# EAGLE schematic uc3843 basic (EAGLE 7.7.0)

## Sheet 1 of 2
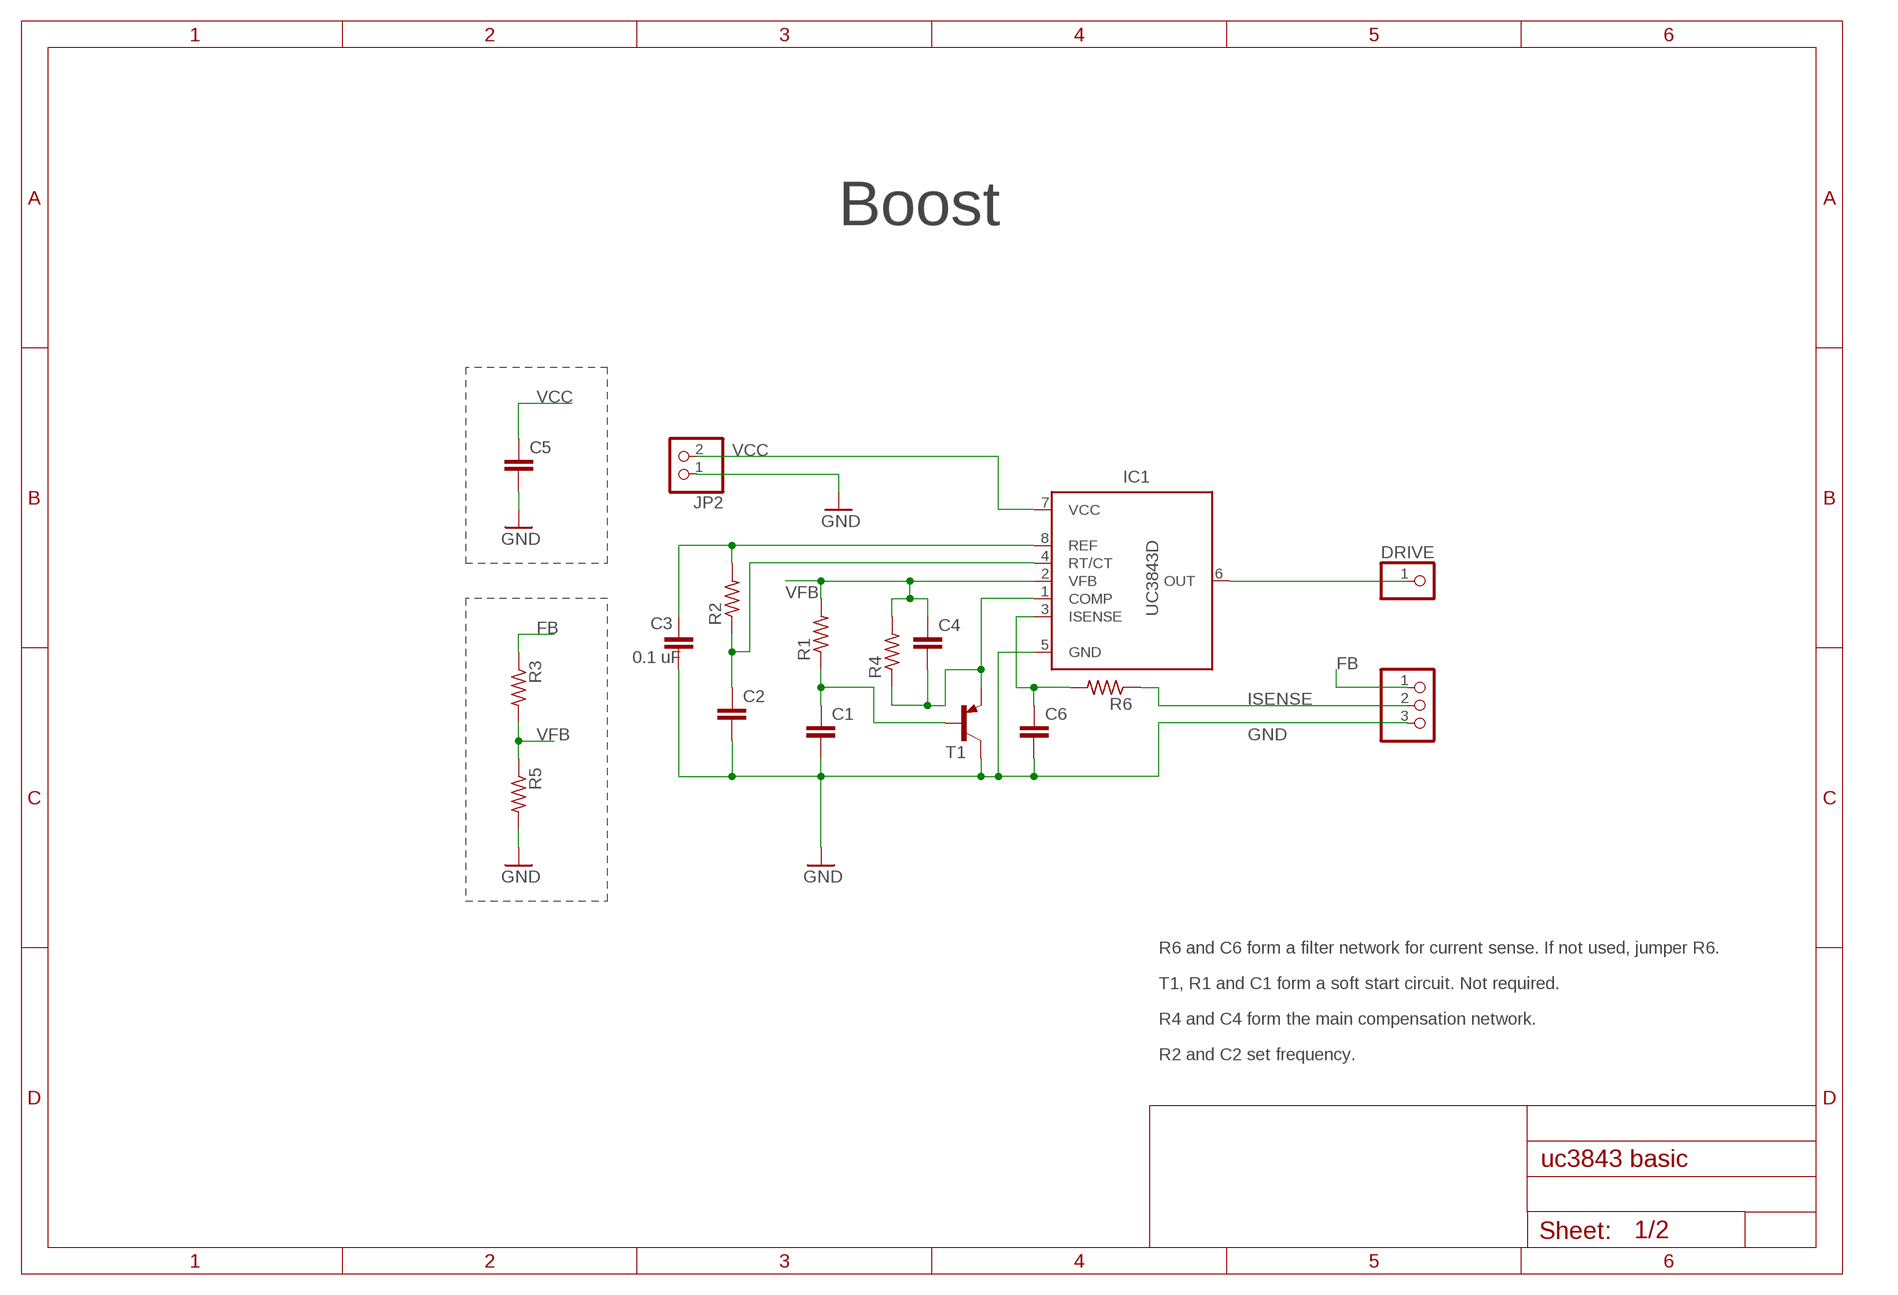
[diagram p0: schematic, sheet 1]

### Parts
C1  C-EUC0805  [C0805]
C2  C-EUC0805  [C0805]
C3  0.1 uF  C-EUC0805  [C0805]
C4  C-EUC0805  [C0805]
C5  C-EUC0805  [C0805]
C6  C-EUC0805  [C0805]
DRIVE  PINHD-1X1  [1X01]
IC1  UC3843D  [D_R-PDSO-G08]
JP1  PINHD-1X3  [1X03]
JP2  PINHD-1X2  [1X02]
R1  R-US_R0805  [R0805]
R2  R-US_R0805  [R0805]
R3  R-US_R0805  [R0805]
R4  R-US_R0805  [R0805]
R5  R-US_R0805  [R0805]
R6  R-US_R0805  [R0805]
T1  -PNP-SOT23-BCE  [SOT23-BCE]

### Nets
COMP: C4.2 IC1.1(COMP) R4.1 T1.E
FB: JP1.1 R3.1
GND: C1.2 C2.2 C3.2 C5.2 C6.2 IC1.5(GND) JP1.3 JP2.1 R5.2 T1.C ; also sheet 2
ISENSE: C6.1 IC1.3(ISENSE) R6.2 ; also sheet 2
N$1: JP1.2 R6.1
N$4: C1.1 R1.1 T1.B
N$6: C2.1 IC1.4(RT/CT) R2.1
N$7: DRIVE.1 IC1.6(OUT)
REF: C3.1 IC1.8(REF) R2.2
VCC: C5.1 IC1.7(VCC) JP2.2 ; also sheet 2
VFB: C4.1 IC1.2(VFB) R1.2 R3.2 R4.2 R5.1 ; also sheet 2

### Notes on the sheet
- Boost
- R6 and C6 form a filter network for current sense. If not used, jumper R6.
- T1, R1 and C1 form a soft start circuit. Not required.
- R4 and C4 form the main compensation network.
- R2 and C2 set frequency.

## Sheet 2 of 2
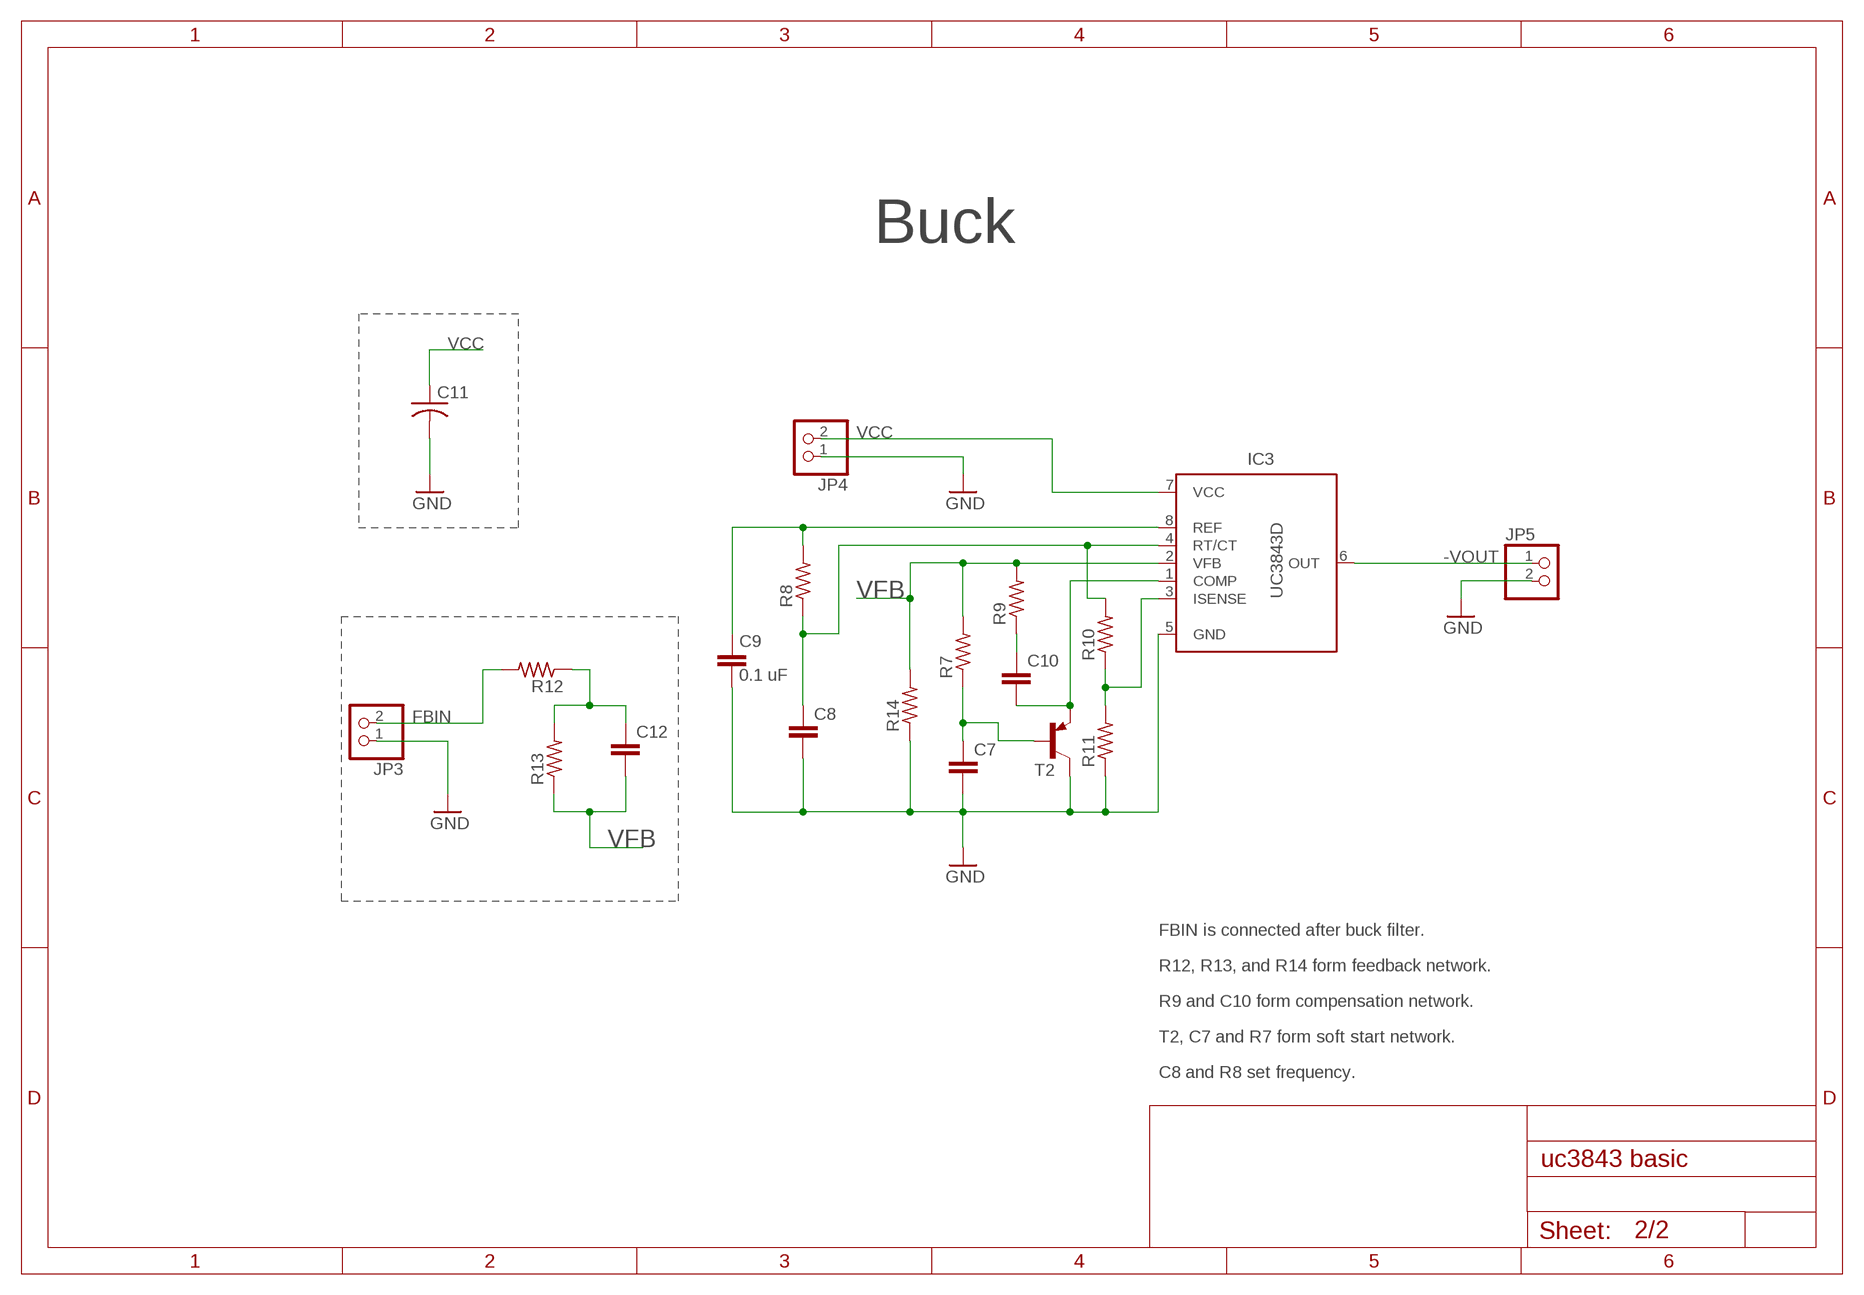
[diagram p1: schematic, sheet 2]

### Parts
C7  C-EUC0805  [C0805]
C8  C-EUC0805  [C0805]
C9  0.1 uF  C-EUC0805  [C0805]
C10  C-EUC0805  [C0805]
C11  C-USC0805  [C0805]
C12  C-EUC0805  [C0805]
IC3  UC3843D  [D_R-PDSO-G08]
JP3  PINHD-1X2  [1X02]
JP4  PINHD-1X2  [1X02]
JP5  PINHD-1X2  [1X02]
R7  R-US_R0805  [R0805]
R8  R-US_R0805  [R0805]
R9  R-US_R0805  [R0805]
R10  R-US_R0805  [R0805]
R11  R-US_R0805  [R0805]
R12  R-US_R0805  [R0805]
R13  R-US_R0805  [R0805]
R14  R-US_R0805  [R0805]
T2  -PNP-SOT23-BCE  [SOT23-BCE]

### Nets
-VOUT: IC3.6(OUT) JP5.1
COMP1: C10.2 IC3.1(COMP) T2.E
FBIN: JP3.2 R12.2
GND: C7.2 C8.2 C9.2 C11.2 IC3.5(GND) JP3.1 JP4.1 JP5.2 R11.1 R14.1 T2.C ; also sheet 1
ISENSE: IC3.3(ISENSE) R10.1 R11.2 ; also sheet 1
N$2: C7.1 R7.1 T2.B
N$3: C8.1 IC3.4(RT/CT) R8.1 R10.2
N$5: C10.1 R9.1
N$9: C12.1 R12.1 R13.2
REF1: C9.1 IC3.8(REF) R8.2
VCC: C11.1 IC3.7(VCC) JP4.2 ; also sheet 1
VFB: C12.2 IC3.2(VFB) R7.2 R9.2 R13.1 R14.2 ; also sheet 1

### Notes on the sheet
- Buck
- FBIN is connected after buck filter.
- R12, R13, and R14 form feedback network.
- R9 and C10 form compensation network.
- T2, C7 and R7 form soft start network.
- C8 and R8 set frequency.

## Library data of the parts
C1-C10 C12 = rcl:C-EU: CAPACITOR, European symbol
C11 = rcl:C-US: CAPACITOR, American symbol
DRIVE = pinhead:PINHD-1X1: PIN HEADER
IC1 IC3 = texas:UC*84?: CURRENT-MODE PWM CONTROLLER Source: Data sheet <http://focus.ti.com/lit/ds/symlink/uc2843.pdf>; MF: UNITRODE; MPN: UC3843D8; OC_FARNELL: 1101424
JP1 = pinhead:PINHD-1X3: PIN HEADER
JP2-JP5 = pinhead:PINHD-1X2: PIN HEADER
R1-R14 = resistor:R-US_: RESISTOR, American symbol
T1 T2 = transistor:*-PNP-: PNP Transistror